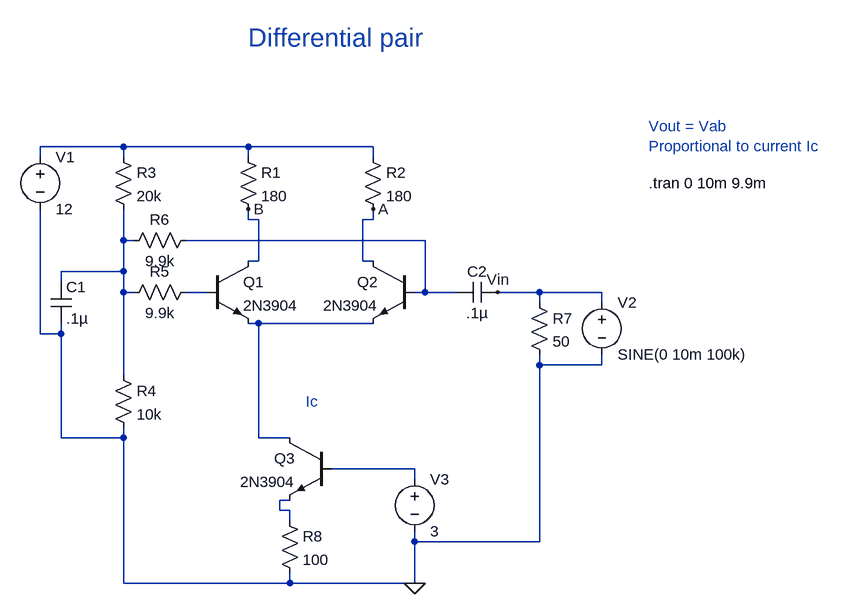
[diagram p0: schematic Differential-pair.asc]
Differential-pair.asc, the LTspice schematic file:
Version 4.1
SHEET 1 1076 692
WIRE -160 240 -160 256
WIRE -64 400 -64 416
WIRE 576 288 576 304
WIRE 192 624 192 640
WIRE -192 64 -192 80
WIRE 672 288 672 304
WIRE 384 560 384 576
WIRE -160 256 -192 256
WIRE -192 256 -192 80
WIRE -160 256 -160 416
WIRE -160 416 -64 416
WIRE -64 416 -64 640
WIRE -64 640 192 640
WIRE 192 640 384 640
WIRE 384 640 384 576
WIRE 384 576 576 576
WIRE 576 576 576 304
WIRE 576 304 672 304
FLAG 384 640 0
WIRE 320 144 304 144
WIRE 320 64 320 80
WIRE 304 144 304 80
WIRE 304 80 320 80
FLAG 320 64 A
WIRE 128 144 144 144
WIRE 128 64 128 80
WIRE 144 144 144 80
WIRE 144 80 128 80
FLAG 128 64 B
WIRE 128 -16 128 -32
WIRE 320 -16 320 -32
WIRE -64 -16 -64 -32
WIRE -192 -16 -192 -32
WIRE 128 -32 -64 -32
WIRE -64 -32 -192 -32
WIRE 128 -32 320 -32
WIRE -160 176 -160 160
WIRE -64 64 -64 80
WIRE -64 320 -64 304
WIRE -48 192 -64 192
WIRE -48 112 -64 112
WIRE -160 160 -64 160
WIRE -64 160 -64 192
WIRE -64 192 -64 112
WIRE -64 112 -64 80
WIRE -64 192 -64 304
WIRE 448 192 432 192
WIRE 384 192 400 192
WIRE 32 112 48 112
WIRE 432 192 400 192
WIRE 400 192 400 112
WIRE 400 112 48 112
WIRE 64 192 48 192
WIRE 32 192 48 192
WIRE 128 240 144 240
WIRE 320 240 304 240
WIRE 192 416 176 416
WIRE 144 240 304 240
WIRE 144 240 144 416
WIRE 144 416 176 416
WIRE 256 464 272 464
WIRE 384 480 384 464
WIRE 272 464 384 464
WIRE 192 512 176 512
WIRE 192 544 192 528
WIRE 176 512 176 528
WIRE 176 528 192 528
WIRE 512 192 528 192
WIRE 576 208 576 192
WIRE 672 208 672 192
WIRE 528 192 576 192
WIRE 576 192 672 192
FLAG 512 192 Vin
SYMBOL npn 64 144 R0
SYMATTR InstName Q1
SYMATTR Value 2N3904
SYMBOL npn 384 144 M0
SYMATTR InstName Q2
SYMATTR Value 2N3904
SYMBOL res 112 -32 R0
SYMATTR InstName R1
SYMATTR Value 180
SYMBOL res 304 -32 R0
SYMATTR InstName R2
SYMATTR Value 180
SYMBOL voltage -192 -32 R0
WINDOW 123 0 0 Left 2
WINDOW 39 0 0 Left 2
SYMATTR InstName V1
SYMATTR Value 12
SYMBOL res -80 -32 R0
SYMATTR InstName R3
SYMATTR Value 20k
SYMBOL res -80 304 R0
SYMATTR InstName R4
SYMATTR Value 10k
SYMBOL res 48 176 R90
WINDOW 0 0 56 VBottom 2
WINDOW 3 32 56 VTop 2
SYMATTR InstName R5
SYMATTR Value 9.9k
SYMBOL res 48 96 R90
WINDOW 0 0 56 VBottom 2
WINDOW 3 32 56 VTop 2
SYMATTR InstName R6
SYMATTR Value 9.9k
SYMBOL cap -176 176 R0
SYMATTR InstName C1
SYMATTR Value .1µ
SYMBOL cap 512 176 R90
WINDOW 0 0 32 VBottom 2
WINDOW 3 32 32 VTop 2
SYMATTR InstName C2
SYMATTR Value .1µ
SYMBOL res 560 192 R0
SYMATTR InstName R7
SYMATTR Value 50
SYMBOL voltage 672 192 R0
WINDOW 123 0 0 Left 2
WINDOW 39 0 0 Left 2
SYMATTR InstName V2
SYMATTR Value SINE(0 10m 100k)
SYMBOL npn 256 416 M0
SYMATTR InstName Q3
SYMATTR Value 2N3904
SYMBOL res 176 528 R0
SYMATTR InstName R8
SYMATTR Value 100
SYMBOL voltage 384 464 R0
WINDOW 123 0 0 Left 2
WINDOW 39 0 0 Left 2
SYMATTR InstName V3
SYMATTR Value 3
TEXT 744 24 Left 2 !.tran 0 10m 9.9m
TEXT 744 -64 Left 2 ;Vout = Vab\nProportional to current Ic
TEXT 216 360 Left 2 ;Ic
TEXT 128 -200 Left 4 ;Differential pair

The netlist it stands for:
* Differential-pair.asc
Q1 B N004 N005 0 2N3904
Q2 A N003 N005 0 2N3904
R1 N001 B 180
R2 N001 A 180
V1 N001 0 12
R3 N001 N002 20k
R4 N002 0 10k
R5 N004 N002 9.9k
R6 N003 N002 9.9k
C1 N002 0 .1µ
C2 Vin N003 .1µ
R7 Vin 0 50
V2 Vin 0 SINE(0 10m 100k)
Q3 N005 N006 N007 0 2N3904
R8 N007 0 100
V3 N006 0 3
.model NPN NPN
.model PNP PNP
.lib standard.bjt
.tran 0 10m 9.9m
* Vout = Vab
* Proportional to current Ic
* Ic
* Differential pair
.backanno
.end